# EAGLE design MKRETHShieldV2.0 (EAGLE 9.1.1)
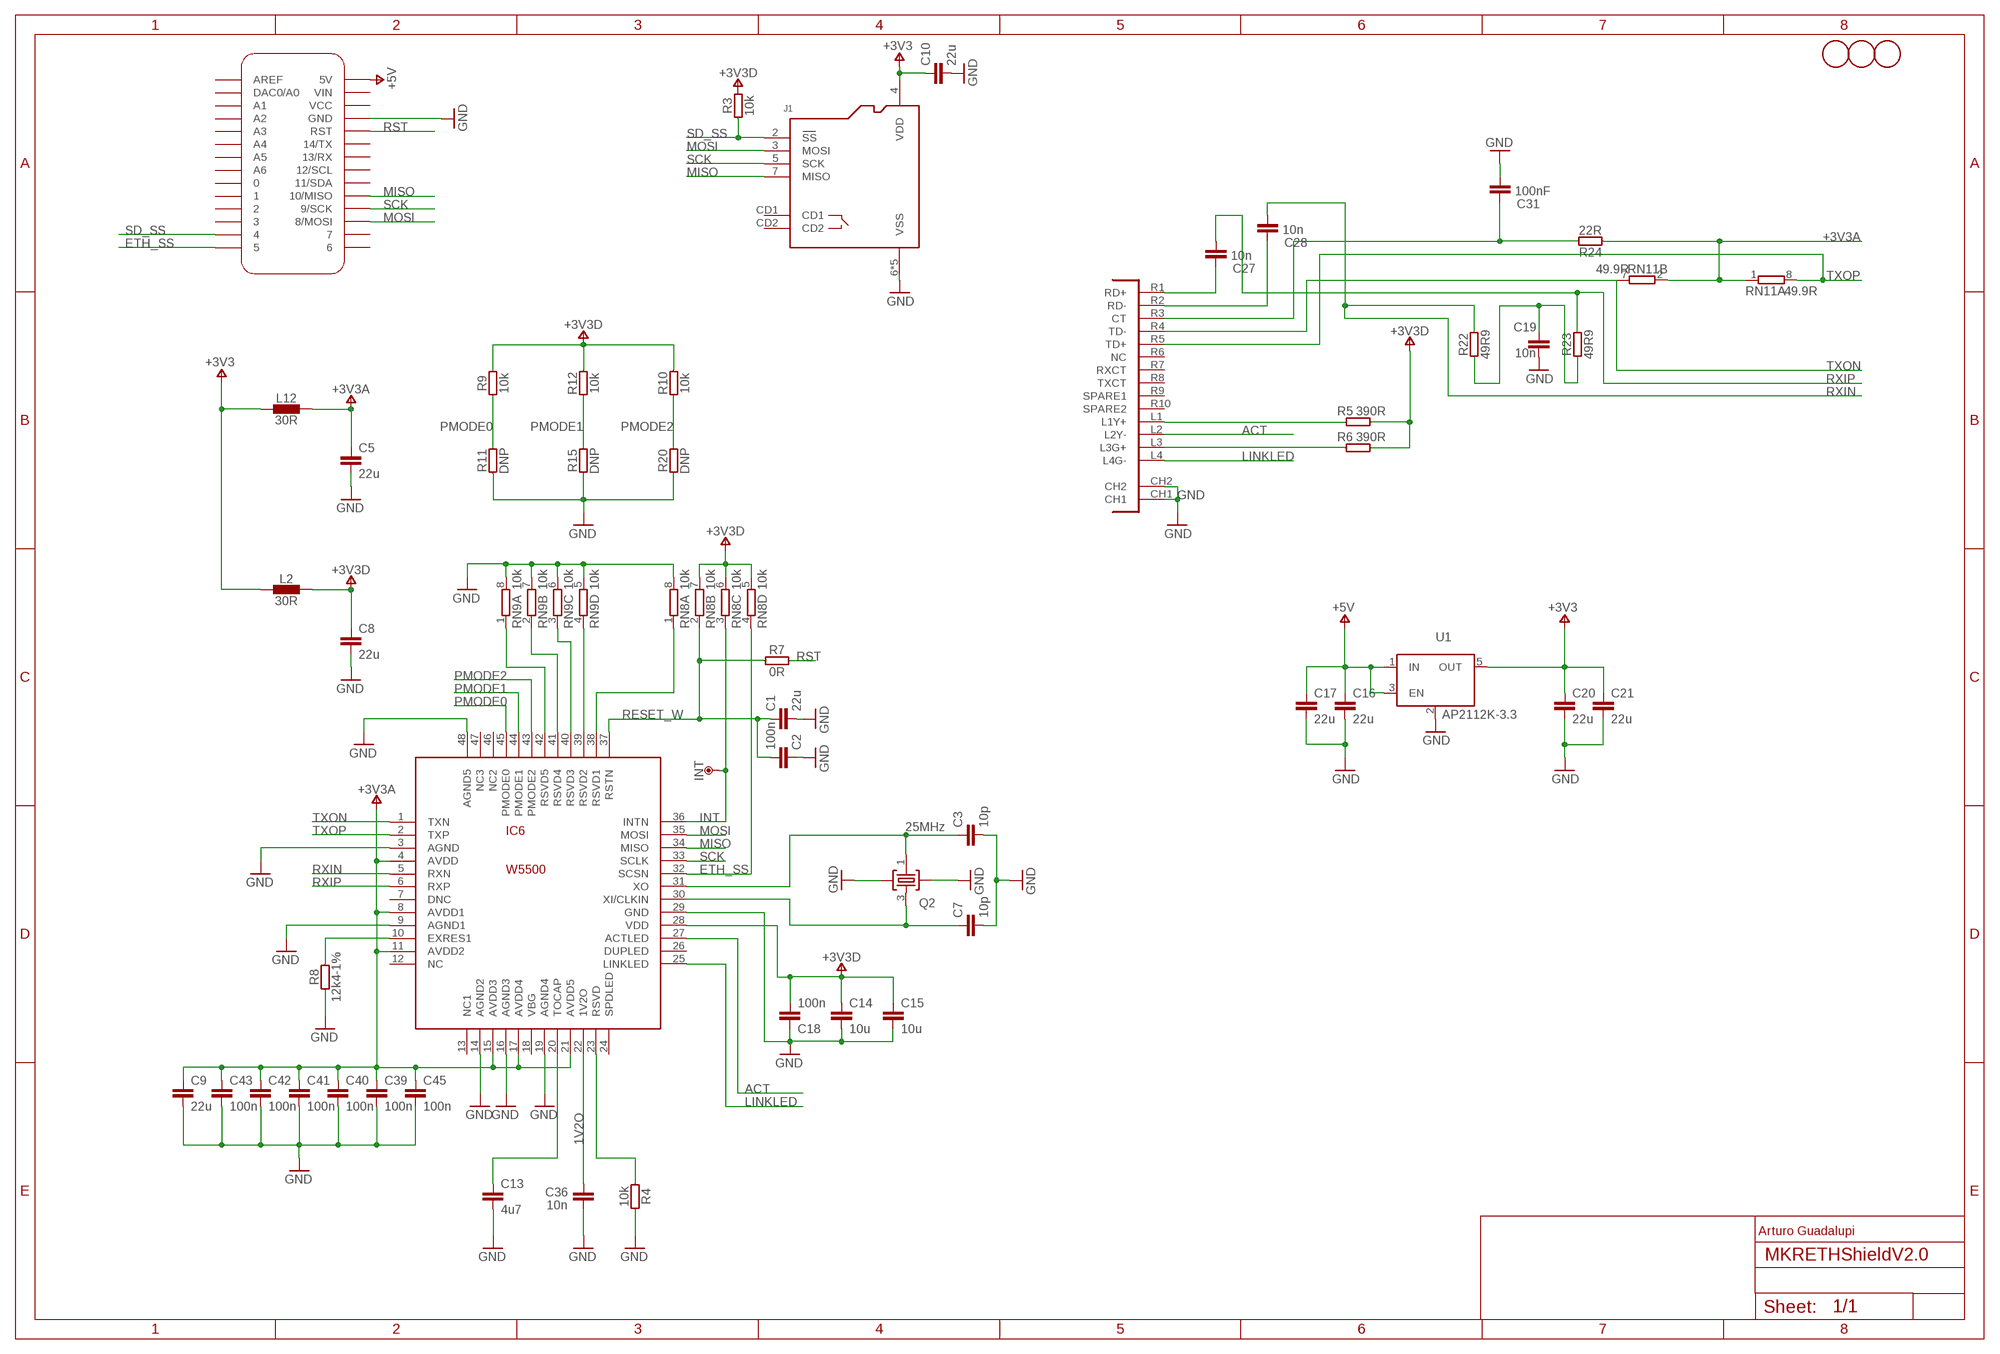
[diagram p0: schematic, sheet 1]

## Parts
C1  22u  C-22U-0805  [0805-R2013X50N]
C2  100n  C-100NF-0402  [0402-1005X55N]
C3  10p  C-10PF-0402  [0402-1005X55N]
C5  22u  C-22U-0805  [0805-R2013X50N]
C7  10p  C-10PF-0402  [0402-1005X55N]
C8  22u  C-22U-0805  [0805-R2013X50N]
C9  22u  C-22U-0805  [0805-R2013X50N]
C10  22u  C-22U-0805  [0805-R2013X50N]
C13  4u7  C-4.7UF-0603  [0603-1608X90N]
C14  10u  C-10UF-0603  [0603-1608X90N]
C15  10u  C-10UF-0603  [0603-1608X90N]
C16  22u  C-22U-0805  [0805-R2013X50N]
C17  22u  C-22U-0805  [0805-R2013X50N]
C18  100n  C-100NF-0402  [0402-1005X55N]
C19  10n  C-10NF-0402  [0402-1005X55N]
C20  22u  C-22U-0805  [0805-R2013X50N]
C21  22u  C-22U-0805  [0805-R2013X50N]
C27  10n  C-10NF-0402  [0402-1005X55N]
C28  10n  C-10NF-0402  [0402-1005X55N]
C31  100nF  C-100NF-0402  [0402-1005X55N]
C36  10n  C-10NF-0402  [0402-1005X55N]
C39  100n  C-100NF-0402  [0402-1005X55N]
C40  100n  C-100NF-0402  [0402-1005X55N]
C41  100n  C-100NF-0402  [0402-1005X55N]
C42  100n  C-100NF-0402  [0402-1005X55N]
C43  100n  C-100NF-0402  [0402-1005X55N]
C45  100n  C-100NF-0402  [0402-1005X55N]
FRAME1  DNP  A3-FRAME-STANDARD  [FRAME]
IC6  W5500  [TQFP48-7X7]
INT  DNP  TPTP-1.27MM  [TP-1.27MM]
J1  -  SD_AMPHENOL-SPI  [AMPHENOL_114-00841-68]
L2  30R  FERRITE-30R0805  [0805-R2013X50N]
L12  30R  FERRITE-30R0805  [0805-R2013X50N]
MKR1  DNP  MKRBOARD-DNP-DIM  [MKRBOARD-DIM]
Q2  25MHz  25MHZ  [CRYSTAL3.2X2.5]
R3  10k  R-10K-0402  [0402-1005X55N]
R4  10k  R-10K-0402  [0402-1005X55N]
R5  390R  R-390R-0402  [0402-1005X55N]
R6  390R  R-390R-0402  [0402-1005X55N]
R7  0R  R-0R-0402  [0402-1005X55N]
R8  12k4-1%  R12K4-1%-0402  [0402-1005X55N]
R9  10k  R-10K-0402  [0402-1005X55N]
R10  10k  R-10K-0402  [0402-1005X55N]
R11  DNP  R-DNP-0402  [0402-1005X55N]
R12  10k  R-10K-0402  [0402-1005X55N]
R15  DNP  R-DNP-0402  [0402-1005X55N]
R20  DNP  R-DNP-0402  [0402-1005X55N]
R22  49R9  R-49R9-0402  [0402-1005X55N]
R23  49R9  R-49R9-0402  [0402-1005X55N]
R24  22R  R-22R-0402  [0402-1005X55N]
RN8  10k  4R-N-10KCAY16  [CAY16]
RN9  10k  4R-N-10KCAY16  [CAY16]
RN11  49.9R  4R-N-49.9RCAY16  [CAY16]
U1  AP2112K-3.3  [SOT25]
U$1  DNP  FIDUCIAL-1.5MM  [FD-1-1.5]
U$2  DNP  FIDUCIAL-1.5MM  [FD-1-1.5]
U$3  DNP  FIDUCIAL-1.5MM  [FD-1-1.5]
UC1  -  ETH-CON-RB1-125BHQ1A  [POE-RJ45]

## Nets
1V2O: C36.2 IC6.22(1V2O)
+3V3 [power]: C10.1 C20.1 C21.1 J1.4(VDD) L2.1 L12.1 U1.5(OUT)
+3V3A [power]: C5.1 C9.1 C39.1 C40.1 C41.1 C42.1 C43.1 C45.1 IC6.4(AVDD) IC6.8(AVDD1) IC6.11(AVDD2) IC6.15(AVDD3) IC6.17(AVDD4) IC6.21(AVDD5) L12.2 R24.1 RN11.1 RN11.2
+3V3D: C8.1 C14.1 C15.1 C18.2 IC6.28(VDD) L2.2 R3.2 R5.2 R6.2 R9.2 R10.2 R12.2 RN8.5 RN8.6 RN8.7
+5V [power]: C16.1 C17.1 MKR1.5V U1.1(IN) U1.3(EN)
ACT: IC6.27(ACTLED) UC1.L2(L2Y-)
ETH_SS: IC6.32(SCSN) MKR1.5 RN8.4
GND [power]: C1.2 C2.1 C3.2 C5.2 C7.2 C8.2 C9.2 C10.2 C13.2 C14.2 C15.2 C16.2 C17.2 C18.1 C19.1 C20.2 C21.2 C31.1 C36.1 C39.2 C40.2 C41.2 C42.2 C43.2 C45.2 IC6.3(AGND) IC6.9(AGND1) IC6.14(AGND2) IC6.16(AGND3) IC6.19(AGND4) IC6.29(GND) IC6.48(AGND5) J1.6(VSS) J1.SH1(VSS) J1.SH2(VSS) J1.SH3(VSS) J1.SH4(VSS) MKR1.GND Q2.2 Q2.4 R4.1 R8.1 R11.1 R15.1 R20.1 RN8.8 RN9.5 RN9.6 RN9.7 RN9.8 U1.2(GND/ADJ) UC1.CH1 UC1.CH2
INT: IC6.36(INTN) INT.X RN8.3
LINKLED: IC6.25(LINKLED) UC1.L4(L4G-)
MISO: IC6.34(MISO) J1.7(MISO) MKR1.10(10/MISO)
MOSI: IC6.35(MOSI) J1.3(MOSI) MKR1.8(8/MOSI)
N$9: C3.1 IC6.31(XO) Q2.1
N$13: IC6.39(RSVD2) RN9.4
N$22: R6.1 UC1.L3(L3G+)
N$24: IC6.23(RSVD) R4.2
N$25: R5.1 UC1.L1(L1Y+)
N$26: C19.2 R22.1 R23.1
N$27: C27.2 UC1.R1(RD+)
N$28: C28.2 UC1.R2(RD-)
N$31: IC6.40(RSVD3) RN9.3
N$35: IC6.41(RSVD4) RN9.2
N$36 [power]: C31.2 R24.2 UC1.R3(CT)
N$37: IC6.42(RSVD5) RN9.1
N$38: C13.1 IC6.20(TOCAP)
N$39: IC6.38(RSVD1) RN8.1
N$40: IC6.10(EXRES1) R8.2
OSC2E2: C7.1 IC6.30(XI/CLKIN) Q2.3
PMODE0: IC6.45(PMODE0) R9.1 R11.2
PMODE1: IC6.44(PMODE1) R12.1 R15.2
PMODE2: IC6.43(PMODE2) R10.1 R20.2
RESET_W: C1.1 C2.2 IC6.37(RSTN) R7.1 RN8.2
RST: MKR1.RST R7.2
RXIN: C28.1 IC6.5(RXN) R22.2
RXIP: C27.1 IC6.6(RXP) R23.2
SCK: IC6.33(SCLK) J1.5(SCK) MKR1.9(9/SCK)
SD_SS: J1.2(SS) MKR1.4 R3.1
TXON: IC6.1(TXN) RN11.7 UC1.R4(TD-)
TXOP: IC6.2(TXP) RN11.8 UC1.R5(TD+)
Unconnected: IC6.7(DNC) IC6.13(NC1) IC6.18(VBG) IC6.24(SPDLED) IC6.46(NC2) IC6.47(NC3) J1.CD1 J1.CD2 MKR1.0 MKR1.1 MKR1.2 MKR1.3 MKR1.6 MKR1.7 MKR1.11(11/SDA) MKR1.12(12/SCL) MKR1.13(13/RX) MKR1.14(14/TX) MKR1.A0(DAC0/A0) MKR1.A1 MKR1.A2 MKR1.A3 MKR1.A4 MKR1.A5 MKR1.A6 MKR1.AREF MKR1.VCC MKR1.VIN RN11.3 RN11.4 RN11.5 RN11.6 UC1.R6(NC) UC1.R7(RXCT) UC1.R8(TXCT) UC1.R9(SPARE1) UC1.R10(SPARE2)

## Notes on the sheet
- Arturo Guadalupi

## Power pins joined to a net without a drawn wire
DUPLED: IC6.26(DUPLED)
NC: IC6.12(NC)

## Library data of the parts
C1 C5 C8-C10 C16 C17 C20 C21 = Arduino-rcl:C: SMD Capacitor; CODE-ARDUINO: 2233; DATASHEET: https://media.digikey.com/pdf/Data%20Sheets/Samsung%20PDFs/CL21A226MQCLQNC_character.pdf; DISTRIBUTOR-LINK: https://www.digikey.com/product-detail/en/samsung-electro-mechanics-america-inc/CL21A226MQCLQNC/1276-2412-1-ND/3890498; DISTRIBUTOR-PN: 1276-2412-1-ND; MANUFACTURER: Samsung; MANUFACTURER-PN: CL21A226MQCLQNC
C2 C18 C31 C39-C43 C45 = Arduino-rcl:C: SMD Capacitor; CODE-ARDUINO: 0132; DATASHEET: http://www.tdk.com/pdf/TDKMLCCCapRange.pdf; DISTRIBUTOR-LINK: http://www.digikey.com/product-detail/en/tdk-corporation/C1005X5R1H104K050BB/445-5942-1-ND/2443982; DISTRIBUTOR-PN: 445-5942-1-ND; MANUFACTURER: TDK; MANUFACTURER-PN: C1005X5R1H104K050BB
C3 C7 = Arduino-rcl:C: SMD Capacitor; CODE-ARDUINO: 3382; DATASHEET: http://search.murata.co.jp/Ceramy/image/img/A01X/partnumbering_e_01.pdf; DISTRIBUTOR-LINK: https://www.digikey.com/product-detail/en/murata-electronics-north-america/GRM1555C1H100FA01D/490-6186-1-ND/3845386; DISTRIBUTOR-PN: 490-6186-1-ND; MANUFACTURER: Murata; MANUFACTURER-PN: GRM1555C1H100FA01D
C13 = Arduino-rcl:C: SMD Capacitor; CODE-ARDUINO: 0458; DATASHEET: http://www.murata.com/~/media/webrenewal/support/library/catalog/products/capacitor/mlcc/c02e.pdf; DISTRIBUTOR-LINK: http://www.digikey.com/product-search/en?keywords=490-7203-1-ND; DISTRIBUTOR-PN: 490-7203-1-ND; MANUFACTURER: Murata; MANUFACTURER-PN: GRM188R61E475KE11D
C14 C15 = Arduino-rcl:C: SMD Capacitor; CODE-ARDUINO: 2213; DATASHEET: http://www.murata.com/~/media/webrenewal/support/library/catalog/products/capacitor/mlcc/c02e.pdf; DISTRIBUTOR-LINK: http://www.digikey.com/product-search/en?keywords=490-10728-1-ND; DISTRIBUTOR-PN: 490-10728-1-ND; MANUFACTURER: Murata; MANUFACTURER-PN: GRM188R61C106KAALD
C19 C27 C28 C36 = Arduino-rcl:C: SMD Capacitor; CODE-ARDUINO: 0165; DATASHEET: http://search.murata.co.jp/Ceramy/image/img/A01X/partnumbering_e_01.pdf; DISTRIBUTOR-LINK: http://www.digikey.com/product-detail/en/murata-electronics-north-america/GRM155R71H103KA88J/490-6351-1-ND/3845548; DISTRIBUTOR-PN: 490-6351-1-ND; MANUFACTURER: Murata; MANUFACTURER-PN: GRM155R71H103KA88J
FRAME1 = Arduino-utility:A3-FRAME: Schematic frame; CODE-ARDUINO: DNP; DATASHEET: DNP; DISTRIBUTOR-LINK: DNP; DISTRIBUTOR-PN: DNP; MANUFACTURER: DNP; MANUFACTURER-PN: DNP
IC6 = Arduino-ICs:W5500: W5500 Hardwired TCP/IP Ethernet controller; CODE-ARDUINO: 0982; DATASHEET: http://wizwiki.net/wiki/lib/exe/fetch.php?media=products:w5500:w5500_ds_v106e_141230.pdf; DISTRIBUTOR-LINK: https://www.digikey.com/product-detail/en/wiznet/W5500/1278-1021-ND/4425702; DISTRIBUTOR-PN: 1278-1021-ND; MANUFACTURER: WizNet; MANUFACTURER-PN: W5500
INT = Arduino-utility:TP: Testpoint; DATASHEET: DNP; DISTRIBUTOR-LINK: DNP; DISTRIBUTOR-PN: DNP; MANUFACTURER: DNP; MANUFACTURER-PN: DNP
J1 = Arduino-connectors:SD_AMPHENOL-SPI: Micro SD connector; CODE-ARDUINO: 0046; DATASHEET: https://www.amphenolcanada.com/ProductSearch/drawings/AC/1140084168.pdf; DISTRIBUTOR-LINK: http://www.digikey.com/product-detail/en/amphenol-commercial-products/114-00841-68/114-00841-68-1-ND/2187101; DISTRIBUTOR-PN: 114-00841-68-1-ND; MANUFACTURER: Amphenol; MANUFACTURER-PN: 114-00841-68
L2 L12 = Arduino-rcl:FERRITE: SMD ferrite; CODE-ARDUINO: 0001; DATASHEET: https://media.digikey.com/pdf/Data%20Sheets/Samsung%20PDFs/Chip_Inductor_Catalog_2014.pdf; DISTRIBUTOR-LINK: https://www.digikey.com/products/en?keywords=CIB21P300NE; DISTRIBUTOR-PN: CIB21P300NE-ND; MANUFACTURER: Samsung; MANUFACTURER-PN: CIB21P300NE
MKR1 = Arduino-utility:MKRBOARD: MKR board footprint; DATASHEET: DNP; DISTRIBUTOR-LINK: DNP; DISTRIBUTOR-PN: DNP; MANUFACTURER: DNP; MANUFACTURER-PN: DNP
Q2 = Arduino-crystals:25MHZ: 25Mhz - K7 12pF - SMD; CODE-ARDUINO: 2359; DATASHEET: https://abracon.com/Resonators/ABM8G.pdf; DISTRIBUTOR-LINK: https://www.digikey.com/product-detail/en/abracon-llc/ABM8G-25.000MHZ-B4Y-T/535-10297-1-ND/2218110; DISTRIBUTOR-PN: 535-10297-1-ND; MANUFACTURER: Abracon LLC; MANUFACTURER-PN: ABM8G-25.000MHZ-B4Y-T
R3 R4 R9 R10 R12 = Arduino-rcl:R: SMD Resistor; CODE-ARDUINO: 0136; DATASHEET: www.yageo.com.tw/exep/pages/download/literatures/PYu-R_INT-thick_7.pdf; DISTRIBUTOR-LINK: http://www.digikey.com/product-detail/en/yageo/RC0402FR-0710KL/311-10.0KLRCT-ND/729470; DISTRIBUTOR-PN: 311-10.0KLRCT-ND; MANUFACTURER: Yageo; MANUFACTURER-PN: RC0402FR-0710KL; _RESTRICTIONS: NO
R5 R6 = Arduino-rcl:R: SMD Resistor; CODE-ARDUINO: 2195; DATASHEET: www.yageo.com.tw/exep/pages/download/literatures/PYu-R_INT-thick_7.pdf; DISTRIBUTOR-LINK: https://www.digikey.com/product-detail/en/yageo/RC0402FR-07390RL/311-390LRCT-ND/2827929; DISTRIBUTOR-PN: 311-390LRCT-ND; MANUFACTURER: Yageo; MANUFACTURER-PN: RC0402FR-07390RL; _RESTRICTIONS: NO
R7 = Arduino-rcl:R: SMD Resistor; CODE-ARDUINO: 0039; DATASHEET: www.yageo.com.tw/exep/pages/download/literatures/PYu-R_INT-thick_7.pdf; DISTRIBUTOR-LINK: http://www.digikey.com/product-detail/en/yageo/RC0402FR-070RL/311-0.0LRCT-ND/2827888; DISTRIBUTOR-PN: 311-0.0LRCT-ND; MANUFACTURER: Yageo; MANUFACTURER-PN: RC0402FR-070RL; _RESTRICTIONS: NO
R8 = Arduino-rcl:R: SMD Resistor; CODE-ARDUINO: 2297; DATASHEET: http://www.yageo.com/NewPortal/yageodocoutput?fileName=/pdf/R-Chip/PYu-RC_Group_51_RoHS_L_4.pdf; DISTRIBUTOR-LINK: https://www.digikey.com/product-detail/en/yageo/RC0402FR-0712K4L/311-12.4KLRCT-ND/2827940; DISTRIBUTOR-PN: 311-12.4KLRCT-ND; MANUFACTURER: Yageo; MANUFACTURER-PN: RC0402FR-0712K4L; _RESTRICTIONS: 1% only
R11 R15 R20 = Arduino-rcl:R: SMD Resistor; CODE-ARDUINO: DNP; DATASHEET: DNP; DISTRIBUTOR-LINK: DNP; DISTRIBUTOR-PN: DNP; MANUFACTURER: DNP; MANUFACTURER-PN: DNP; _RESTRICTIONS: NO
R22 R23 = Arduino-rcl:R: SMD Resistor; CODE-ARDUINO: A5282; DATASHEET: www.yageo.com.tw/exep/pages/download/literatures/PYu-R_INT-thick_7.pdf; DISTRIBUTOR-LINK: https://www.digikey.com/product-detail/en/yageo/RC0402FR-0749R9L/311-49.9LRCT-ND/729568; DISTRIBUTOR-PN: 311-49.9LRCT-ND; MANUFACTURER: Yageo; MANUFACTURER-PN: RC0402FR-0749R9L; _RESTRICTIONS: 1% ONLY
R24 = Arduino-rcl:R: SMD Resistor; CODE-ARDUINO: 0468; DATASHEET: www.yageo.com.tw/exep/pages/download/literatures/PYu-R_INT-thick_7.pdf; DISTRIBUTOR-LINK: http://www.digikey.com/products/en?keywords=311-22.0LRCT-ND; DISTRIBUTOR-PN: 311-22.0LRCT-ND; MANUFACTURER: Yageo; MANUFACTURER-PN: RC0402FR-0722RL; _RESTRICTIONS: NO
RN8 RN9 = Arduino-rcl:4R-N: Array Chip Resistor Source: RS Component / Phycomp; CODE-ARDUINO: 0016; DATASHEET: http://www.bourns.com/docs/Product-Datasheets/CATCAY.pdf; DISTRIBUTOR-LINK: https://www.digikey.com/products/en?keywords=CAY16-103J4LFTR-ND; DISTRIBUTOR-PN: CAY16-103J4LFTR-ND; MANUFACTURER: Bourns Inc.; MANUFACTURER-PN: CAY16-103J4LF
RN11 = Arduino-rcl:4R-N: Array Chip Resistor Source: RS Component / Phycomp; CODE-ARDUINO: 2298; DATASHEET: http://www.bourns.com/docs/Product-Datasheets/CATCAY.pdf; DISTRIBUTOR-LINK: https://www.digikey.com/product-detail/en/bourns-inc/CAY16-49R9F4LF/CAY16-49R9F4LFCT-ND/3437972; DISTRIBUTOR-PN: CAY16-49R9F4LFCT-ND; MANUFACTURER: Bourns Inc.; MANUFACTURER-PN: CAY16-49R9F4LF
U1 = Arduino-ICs:AP2112K-3.3: IC REG LINEAR 3.3V 600mA SOT25; CODE-ARDUINO: 2199; DATASHEET: https://www.diodes.com/assets/Datasheets/AP2112.pdf; DISTRIBUTOR-LINK: https://www.digikey.com/product-detail/en/diodes-incorporated/AP2112K-3.3TRG1/AP2112K-3.3TRG1DITR-ND/4470746; DISTRIBUTOR-PN: AP2112K-3.3TRG1DITR-ND; MANUFACTURER: Diodes Inc; MANUFACTURER-PN: AP2112K-3.3TRG1
U$1-U$3 = Arduino-utility:FIDUCIAL: Fiducial mount; CODE-ARDUINO: DNP; DATASHEET: DNP; DISTRIBUTOR-LINK: DNP; DISTRIBUTOR-PN: DNP; MANUFACTURER: DNP; MANUFACTURER-PN: DNP
UC1 = Arduino-connectors:ETH-CON-RB1-125BHQ1A: RJ45 connector; CODE-ARDUINO: 2300; DATASHEET: https://www2.mouser.com/datasheet/2/443/RB1-125BAG1A(111-00)-1211926.pdf; DISTRIBUTOR-LINK: https://www2.mouser.com/ProductDetail/WIZnet/RB1-125BAG1A?qs=K8aI8m0%252bj2HL3CgJHC4yWQ%3D%3D; DISTRIBUTOR-PN: 950-RB1-125BAG1A; MANUFACTURER: Wiznet; MANUFACTURER-PN: RB1-125BAG1A

## Net classes
1 power: width 0.254 mm, drill 0.3 mm, clearance 0.203 mm
2 gnd: width 0.254 mm, drill 0.3 mm, clearance 0.254 mm

## Board
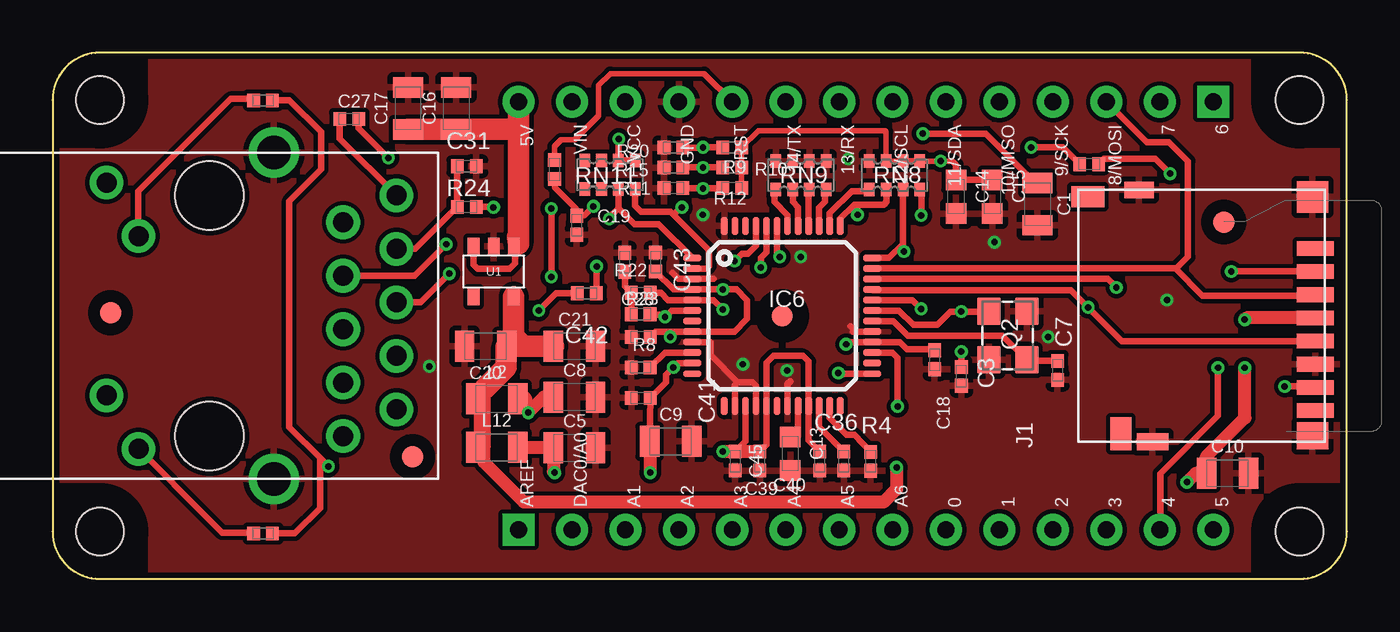
[diagram p1: board, top side]
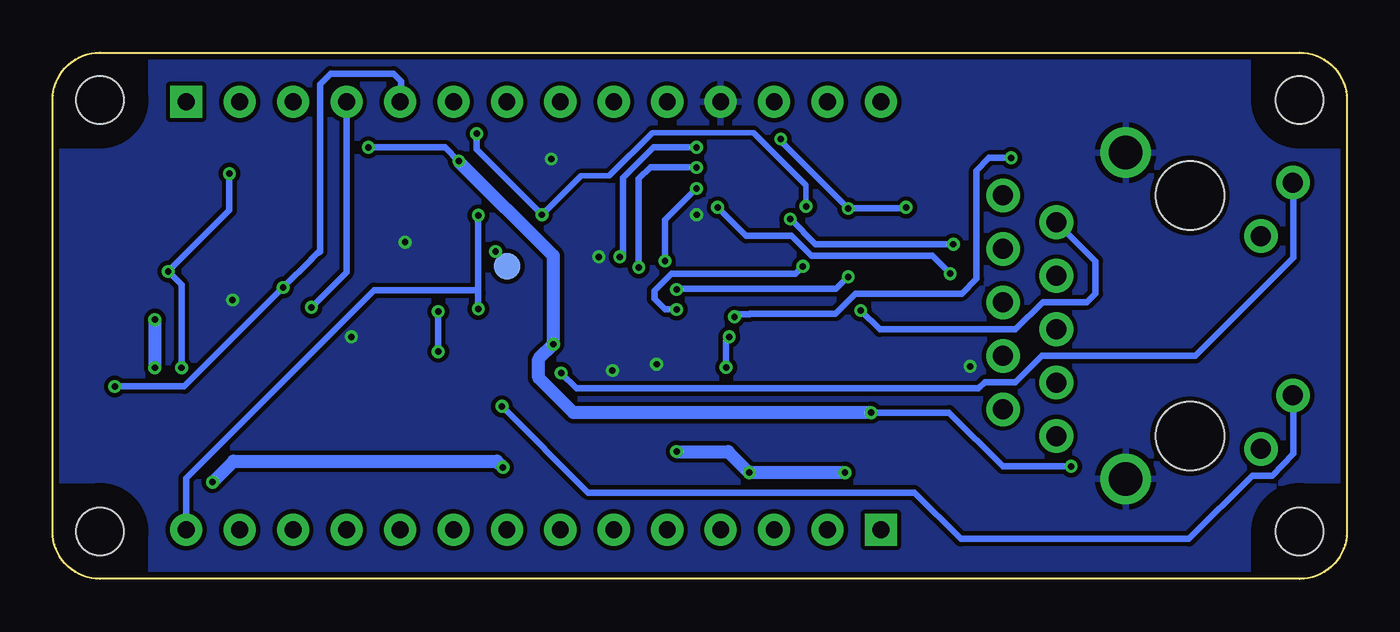
[diagram p2: board, bottom side, seen from below]

Size 61.5 x 25 mm. Coordinates in mm from the lower left corner, seen from the top.
Copper layers (1*16): Top 0.035mm / dielectric 1.5mm / Bottom 0.035mm
Design rules "SeeedStudio_2layers *": minimum track width 6mil, minimum drill 12mil, track to track 7mil, track to pad 6mil, pad to pad 6mil, via to via 6mil, smd to smd 0mil, copper to edge 10mil, drill to drill 10mil, minimum pad ring 10mil, minimum via ring 6mil, stop-mask expansion 2mil, vias tented up to drill 100mil, thermal gap 10mil

### Footprints (pad centres in the part's own frame; a part is rotated, then mirrored left to right if it is on the bottom)
0805-R2013X50N = smd 0.95 x 1.45: 1 -1,0; 2 1,0
0402-1005X55N = smd 0.62 x 0.62: 1 -0.45,0; 2 0.45,0
0603-1608X90N = smd 0.95 x 1: 1 -0.8,0; 2 0.8,0
TQFP48-7X7 = smd 0.85 x 0.32: 1 -4.275,2.75; 2 -4.275,2.25; 3 -4.275,1.75; 4 -4.275,1.25; 5 -4.275,0.75; 6 -4.275,0.25; 7 -4.275,-0.25; 8 -4.275,-0.75; 9 -4.275,-1.25; 10 -4.275,-1.75; 11 -4.275,-2.25; 12 -4.275,-2.75; 25 4.275,-2.75; 26 4.275,-2.25; 27 4.275,-1.75; 28 4.275,-1.25; 29 4.275,-0.75; 30 4.275,-0.25; 31 4.275,0.25; 32 4.275,0.75; 33 4.275,1.25; 34 4.275,1.75; 35 4.275,2.25; 36 4.275,2.75 | smd 0.32 x 0.85: 13 -2.75,-4.275; 14 -2.25,-4.275; 15 -1.75,-4.275; 16 -1.25,-4.275; 17 -0.75,-4.275; 18 -0.25,-4.275; 19 0.25,-4.275; 20 0.75,-4.275; 21 1.25,-4.275; 22 1.75,-4.275; 23 2.25,-4.275; 24 2.75,-4.275; 37 2.75,4.275; 38 2.25,4.275; 39 1.75,4.275; 40 1.25,4.275; 41 0.75,4.275; 42 0.25,4.275; 43 -0.25,4.275; 44 -0.75,4.275; 45 -1.25,4.275; 46 -1.75,4.275; 47 -2.25,4.275; 48 -2.75,4.275 | smd 1 x 1: P$1 0,0
TP-1.27MM = smd 1.27 x 1.27 bottom: X 0,0
AMPHENOL_114-00841-68 = smd 0.7 x 1.75: 1 3.2,-5.888; 2 2.1,-5.888; 3 1,-5.888; 4 -0.1,-5.888; 5 -1.2,-5.888; 6 -2.3,-5.888; 7 -3.4,-5.888; 8 -4.5,-5.888 | smd 1 x 1.55: CD1 5.65,4.912 | smd 1.55 x 1: CD2 -5.602,3.337 | smd 1.3 x 1.5: SH1 -5.7,-5.76 | smd 1.5 x 1.5: SH2 5.65,-5.76 | smd 0.8 x 1.4: SH3 5.975,2.487 | smd 0.8 x 1.5: SH4 -5.975,1.837
MKRBOARD-DIM = drill 0.8 pad 1.524: 0 42.455,2.34; 1 44.995,2.34; 2 47.535,2.34; 3 50.075,2.34; 4 52.615,2.34; 5 55.155,2.34; 5V 22.135,22.66; 7 52.615,22.66; 8 50.075,22.66; 9 47.535,22.66; 10 44.995,22.66; 11 42.455,22.66; 12 39.915,22.66; 13 37.375,22.66; 14 34.835,22.66; A0 24.675,2.34; A1 27.215,2.34; A2 29.755,2.34; A3 32.295,2.34; A4 34.835,2.34; A5 37.375,2.34; A6 39.915,2.34; GND 29.755,22.66; RST 32.295,22.66; VCC 27.215,22.66; VIN 24.675,22.66 | drill 0.8 pad 1.524 square: 6 55.155,22.66; AREF 22.135,2.34 | hole 2.25: 59.25,2.25; 59.25,22.75; 2.25,2.25; 2.25,22.75
CRYSTAL3.2X2.5 = smd 1.3 x 1.1: 1 -1.15,-0.9; 2 1.15,-0.9; 3 1.15,0.9; 4 -1.15,0.9
CAY16 = smd 0.5 x 0.65: 1 -1.2,-0.675; 2 -0.4,-0.675; 3 0.4,-0.675; 4 1.2,-0.675; 5 1.2,0.675; 6 0.4,0.675; 7 -0.4,0.675; 8 -1.2,0.675
SOT25 = smd 0.55 x 0.8: 1 0.95,1.2; 2 0,1.2; 3 -0.95,1.2; 4 -0.95,-1.2; 5 0.95,-1.2
FD-1-1.5 = smd 1.016 x 1.016: P$1 0,0
POE-RJ45 = drill 1.6: CH1 13.94,7.75; CH2 13.94,-7.75 | drill 0.95 pad 1.6: L1 7.51,-6.325; L2 5.99,-3.785; L3 7.51,3.785; L4 5.99,6.325; R1 19.77,5.715; R2 17.23,4.445; R3 19.77,3.175; R4 17.23,1.905; R5 19.77,0.635; R6 17.23,-0.635; R7 19.77,-1.905; R8 17.23,-3.175; R9 19.77,-4.445; R10 17.23,-5.715 | hole 3.25: 10.89,5.715; 10.89,-5.715

### Placement (x,y rotation side)
C1  46.8,17.8 270 top
C2  24.9,16.8 90 top
C3  43.18,9.62 270 top
C5  24.8,6.22 0 top
C7  47.75,9.91 270 top
C8  24.8,8.64 0 top
C9  29.37,6.54 0 top
C10  55.82,5.02 0 top
C13  35.05,5.95 270 top
C14  42.93,18.15 270 top
C15  44.65,18.15 270 top
C16  19.18,22.35 90 top
C17  16.89,22.35 90 top
C18  41.91,10.41 90 top
C19  27.19,15.04 270 top
C20  20.57,11.05 180 top
C21  24.8,11.05 0 top
C27  14.1,21.84 180 top
C28  25.38,13.57 180 top
C31  19.68,19.6 180 top
C36  37.59,5.6 90 top
C39  33.6,5.6 270 top
C40  36.45,5.6 270 top
C41  27.95,8.6 180 top
C42  27.95,11.5 180 top
C43  28.65,15.05 90 top
C45  32.43,5.6 270 top
FRAME1  0,0 0 top
IC6  34.67,12.5 0 top
INT  39.9,14.85 0 top
J1  54.1,12.5 90 top
L2  21.1,8.55 0 top
L12  21.1,6.25 0 top
MKR1  0,0 0 top
Q2  45.39,11.56 270 top
R3  49.25,19.7 180 top
R4  38.87,5.59 90 top
R5  10,2.16 0 top
R6  10,22.73 0 top
R7  23.85,19.45 90 top
R8  27.94,10.04 0 top
R9  32.29,18.57 0 top
R10  32.29,20.49 0 top
R11  29.5,18.57 0 top
R12  32.29,19.54 0 top
R15  29.5,19.54 0 top
R20  29.5,20.49 0 top
R22  27.95,13.59 0 top
R23  27.94,12.57 0 top
R24  19.68,17.67 180 top
RN8  40.01,19.18 0 top
RN9  35.56,19.18 0 top
RN11  26.48,19.2 180 top
U1  20.95,14.61 0 top
U$1  2.75,12.65 0 top
U$2  55.65,16.95 0 top
U$3  17.1,5.8 0 top
UC1  -3.43,12.5 0 top

### Tracks (layer width: path | path; a pad name or v marks a point on that pad's centre or on a via)
1V2O
  Top 0.305: IC6.22 36.42,7.22 C36.2
+3V3  (via drill 0.3)
  Top 0.406: 20.5,6.2 20.1,6.2 L12.1 | 20.52,9.02 20.1,9.02 L2.1 | 20.4,8.64 20.1,8.64
  Top 0.61: J1.4 56.72,12.4 v56.64,12.32 | 20.5,6.2 20.5,5.55 22.4,3.65 39.5,3.65 40.1,4.25 v40.1,5.3 | v56.64,10.03 v56.65,10.03 56.65,7.65 54.82,5.82 C10.1 54.32,5.02 v53.9,4.6
  Top 0.813: L12.1 20.4,6.25 20.4,8.64 | 20.1,8.64 L2.1
  Top 1.016: 22.61,11.05 C20.1 21.55,11.03 21.55,10.05 20.52,9.02 | 22.61,11.05 C21.1 | 22.61,11.05 22.34,11.07 21.91,11.5 U1.5
  Bottom 0.61: v56.64,12.32 v56.64,10.03 | v53.9,4.6 52.9,5.6 40.4,5.6 v40.1,5.3
+3V3A  (via drill 0.3)
  Top 0.305: 29.35,11.75 IC6.8 32.4,11.75 33,12.35 33,13.25 32.5,13.75 v31.85,13.75 IC6.4 29.5,13.75 C43.1 | 29.35,11.75 28.65,11.75 C42.1 | RN11.1 RN11.2 26.88,20.88 v26.9,20.9 | C9.1 C41.1 29.15,9.35 29.15,9.7 v29.5,10.05 29.7,10.25 IC6.11 | C39.1 33.92,6.37 IC6.17 33.92,10.27 34.25,10.6 35.65,10.6 35.92,10.33 IC6.21 35.92,6.58 C40.1 | IC6.15 32.92,6.54 C45.1 | R24.1 20.93,17.67 v20.95,17.65 | v29.35,11.5 29.35,11.75 | v23.7,14.35 v23.7,17.6
  Top 0.61: v23.85,5.05 23.8,5.1 C5.1 23.8,6.25 L12.2 | v28.4,5.05 28.4,6.5 C9.1 | v31.85,6.05 C45.1 C39.1
  Bottom 0.305: v31.85,13.75 31.82,13.78 24.27,13.78 v23.7,14.35 | v29.5,10.05 29.5,11.3 v29.35,11.5 | v20.95,17.65 21,17.6 v23.7,17.6 26.9,20.8 v26.9,20.9
  Bottom 0.61: v23.85,5.05 v28.4,5.05 29.4,6.05 v31.85,6.05
+3V3D  (via drill 0.3)
  Top 0.254: R9.2 R12.2 R10.2 33.55,21.3 39.55,21.3 39.6,21.25 RN8.7 RN8.6 | 42.76,19.85 v42.2,19.85 RN8.5
  Top 0.305: C18.2 41.85,10.92 40.59,10.92 40.26,11.25 IC6.28 37.8,11.25 v37.7,11.15 | RN8.6 RN8.5 | 42.76,19.85 42.93,19.68 C14.1 C15.1 | v46.5,20.5 48,20.5 R3.2 | R5.2 11.51,2.16 12.7,3.35 12.7,5.75 | 12.7,5.75 11.25,7.2 11.25,17.95 12.75,19.45 12.75,21.25 11.25,22.75 10.47,22.75 R6.2 | 12.7,5.75 v13.1,5.35
  Top 0.406: 22.37,8.55 22.6,8.55 v22.6,7.9
  Top 0.61: C8.1 23.34,8.64 v22.6,7.9
  Top 0.813: L2.2 22.37,8.55
  Bottom 0.305: v46.5,20.5 42.85,20.5 v42.2,19.85 | v22.6,7.9 18.9,7.9 16.35,5.35 v13.1,5.35
  Bottom 0.61: v42.2,19.85 37.7,15.35 v37.7,11.15 38.4,10.45 38.4,9.55 36.75,7.9 v22.6,7.9
+5V
  Top 0.305: 22.14,16.38 21.91,16.15 U1.1 21.97,15.74 21.97,14.99 21.72,14.73 20.19,14.73 20,14.92 U1.3
  Top 1.016: C17.1 C16.1 21.86,21.35 22.14,21.08 | MKR1.5V 22.14,21.08 | 22.14,21.08 22.14,16.38 22.14,15.91 22.1,16.26
ACT  (via drill 0.3)
  Top 0.305: v40.15,8.2 40.15,10.5 39.9,10.75 IC6.27
  Bottom 0.305: v40.15,8.2 36.05,4.1 20.55,4.1 18.35,1.9 7.5,1.9 4.5,4.9 3.55,4.9 2.55,5.95 UC1.L2
ETH_SS  (via drill 0.3)
  Top 0.305: IC6.32 40.85,13.25 v41.27,12.83 | v41.27,17.27 41.27,18.43 RN8.4
  Bottom 0.305: v41.27,12.83 41.27,13.59 | 41.27,13.59 v41.27,17.27 | MKR1.5 55.16,4.79 46.23,13.72 41.4,13.72 41.27,13.59
GND  (via drill 0.3)
  Top 0.305: IC6.19 34.92,9.27 35.05,9.4 | 38.04,11.75 IC6.29 38.15,11.75 37.9,12 | IC6.9 31.25,11.25 31.25,10.65 32.55,9.35 | 31.4,14.25 IC6.3 | IC6.3 30.35,14.25 | IC6.3 29.75,14.25 29.45,14.55 | 32.4,9.1 32.42,9.08 IC6.14 32.42,9.22 32.55,9.35 | 32.55,9.35 33.25,9.35 33.42,9.18 IC6.16
  other vias: 44.75,16 35.55,15.3 30.9,17.3 52.95,13.25 37.8,19.95 34.9,9.9 17.9,10.1 47.3,11.5 32.8,10.2
  pour Top: 0,25 62,25 62,0 0,0
  pour Bottom: 0,25 62,25 62,0 0,0
INT  (via drill 0.3)
  Top 0.305: RN8.3 40.41,15.9 | 40.41,15.9 39.75,15.25 IC6.36 | 40.41,15.9 40.41,15.6 v40.45,15.55
  Bottom 0.305: v40.45,15.55 INT.X
LINKLED  (via drill 0.3)
  Top 0.305: v37.34,9.78 37.37,9.75 IC6.25 39.02,9.75
  Bottom 0.305: v37.34,9.78 36.61,9.05 17.5,9.05 17.2,9.35 15.75,9.35 14.5,10.6 7.2,10.6 2.55,15.25 UC1.L4
MISO  (via drill 0.3)
  Top 0.305: v58.55,9.14 59.95,9.14 J1.7 | IC6.34 50.14,14.25 v50.54,13.85
  Bottom 0.305: v58.55,9.14 55.24,9.14 v50.54,13.85 49.2,15.19 49.2,15.2 48.9,15.5 48.85,15.5 48.8,15.55 48.8,23.5 48.3,24 45.3,24 44.95,23.65 44.95,22.7 MKR1.10
MOSI
  Top 0.305: IC6.35 53.35,14.75 | J1.3 59.95,13.46 54.64,13.46 53.35,14.75 | 50.05,22.64 MKR1.8 51.98,20.75 53.05,20.75 53.95,19.85 53.95,15.3 53.4,14.75 53.35,14.75
N$9  (via drill 0.3)
  Top 0.305: IC6.31 40.21,12.75 40.89,12.06 42.04,12.06 42.67,12.7 v43.18,12.7 44.74,12.7 Q2.1 | C3.1 v43.18,10.79
  Bottom 0.305: v43.18,10.79 v43.18,12.7
N$13
  Top 0.305: IC6.39 36.42,17.62 36.7,17.91 36.7,18.45 RN9.4
N$22
  Top 0.305: UC1.L3 4.06,16.3 4.06,18.41 8.45,22.8 9.48,22.8 R6.1
N$24
  Top 0.305: IC6.23 36.92,7.66 37.72,6.86 38.1,6.86 R4.2
N$25
  Top 0.305: UC1.L1 7.4,2.85 7.66,2.6 8.06,2.2 9.51,2.2 R5.1
N$26
  Top 0.305: 27.44,13.66 R22.1 | R22.1 27.5,12.59 R23.1 | C19.2 27.19,13.9 R22.1
N$27
  Top 0.305: C27.2 13.65,20.91 UC1.R1
N$28  (via drill 0.3)
  Top 0.305: C28.2 23.92,13.57 v23.1,12.75
  Bottom 0.305: UC1.R2 11.95,15.09 11.95,13.55 12.35,13.15 14.45,13.15 15.75,11.85 22.2,11.85 v23.1,12.75
N$31
  Top 0.305: IC6.40 35.92,18.46 RN9.3
N$35
  Top 0.305: IC6.41 35.42,17.66 35.18,17.91 35.18,18.48 RN9.2
N$36
  Top 0.305: UC1.R3 17.23,15.68 R24.2 C31.2
N$37
  Top 0.305: IC6.42 34.92,17.28 34.29,17.91 34.29,18.43 RN9.1
N$38
  Top 0.305: IC6.20 35.42,6.77 C13.1
N$39
  Top 0.305: IC6.38 36.92,17.36 37.97,18.41 38.72,18.41 RN8.1
N$40
  Top 0.305: IC6.10 29.09,10.75 R8.2
OSC2E2
  Top 0.305: IC6.30 39.95,12.25 40.64,11.56 45.14,11.56 Q2.3 46.34,10.36 C7.1
PMODE0  (via drill 0.3)
  Top 0.305: R11.2 30.88,18.57 v30.91,18.55 31.82,18.55 R9.1 | IC6.45 33.42,15.82 33.05,15.45 32.75,15.45 v32.4,15.1
  Bottom 0.305: v32.4,15.1 32.4,17.06 v30.91,18.55
PMODE1  (via drill 0.3)
  Top 0.305: R12.1 v30.91,19.54 R15.2 | IC6.44 33.92,15.52 33.65,15.25 v33.65,14.8
  Bottom 0.305: v33.65,14.8 33.65,19 33.1,19.55 31.36,19.55 31.35,19.54 v30.91,19.54
PMODE2  (via drill 0.3)
  Top 0.305: R20.2 30.8,20.49 v30.91,20.5 R10.1 | IC6.43 34.42,15.43 v34.55,15.3
  Bottom 0.305: v34.55,15.3 34.4,15.45 34.4,19.05 32.95,20.5 v30.91,20.5 30.8,20.49
RESET_W  (via drill 0.3)
  Top 0.254: R7.1 23.85,18.6 24.9,17.55 C2.2 25.25,17.25 v25.7,17.7
  Top 0.305: IC6.37 37.42,17.1 38.1,17.78 38.25,17.78 | 38.25,17.78 39.5,17.78 39.62,17.91 39.62,18.48 RN8.2 | v38.25,17.3 38.25,17.78 | v41.35,21.15 44.35,21.15 46.4,19.1 46.5,19.1 C1.1
  Bottom 0.254: v25.7,17.7 25.7,18.7 28.2,21.2 33,21.2 35.05,19.15 36.4,19.15 v38.25,17.3
  Bottom 0.305: v41.35,21.15 41.35,20.4 v38.25,17.3
RST
  Top 0.254: R7.2 23.85,20.55 24.15,20.85 24.8,20.85 25.95,22 25.95,23.45 26.5,24 30.95,24 MKR1.RST
RXIN  (via drill 0.3)
  Top 0.305: R22.2 28.91,13.59 29.25,13.25 IC6.5 31.4,13.25 v31.85,12.8 | v25.85,14.85 25.85,13.59 C28.1
  Bottom 0.305: v31.85,12.8 32.4,12.8 32.9,13.3 32.9,13.7 32.1,14.5 26.2,14.5 v25.85,14.85
RXIP  (via drill 0.3)
  Top 0.305: C27.1 14.55,21.4 v15.95,20 | R23.2 28.41,12.55 29,12.55 v29.1,12.45 29.4,12.75 IC6.6
  Bottom 0.305: v15.95,20 17,20 17.6,19.4 17.6,14.25 18.3,13.55 23.35,13.55 24.3,12.6 28.36,12.6 R23.2 28.98,12.57 v29.1,12.45
SCK  (via drill 0.3)
  Top 0.305: IC6.33 38.98,13.72 48.38,13.72 v49.2,12.9 50.8,11.3 J1.5
  Bottom 0.305: MKR1.9 47.53,14.56 v49.2,12.9
SD_SS  (via drill 0.3)
  Top 0.254: MKR1.4 52.63,2.34
  Top 0.305: v55.37,10.03 55.37,7.75 52.63,5.01 52.63,2.34 | v56.01,14.61 J1.2 | v53.1,19.25 52.4,19.95 49.95,19.95 R3.1
  Bottom 0.305: v55.37,10.03 55.37,13.97 v56.01,14.61 53.1,17.51 v53.1,19.25
TXON  (via drill 0.3)
  Top 0.305: IC6.1 28.8,16.85 27.65,16.85 26.88,17.62 | RN11.7 26.88,17.62 | UC1.R4 17.2,14.4 v18.7,15.9 | v26.45,17.1 26.45,17.18 26.88,17.62
  Bottom 0.305: v18.7,15.9 25.25,15.9 v26.45,17.1
TXOP  (via drill 0.3)
  Top 0.305: 29.51,17.31 29.36,17.45 27.95,17.45 27.68,17.72 RN11.8 | 29.51,17.31 31.19,15.62 31.19,14.86 31.07,14.73 30.41,14.73 IC6.2 | UC1.R5 17.48,13.13 v18.85,14.5 | v29.9,17.65 29.85,17.65 29.51,17.31
  Bottom 0.305: v29.9,17.65 28.55,16.3 26.4,16.3 25.45,15.35 19.7,15.35 v18.85,14.5